# EAGLE design Layout (EAGLE 9.6.0)

## Sheet 1 of 2
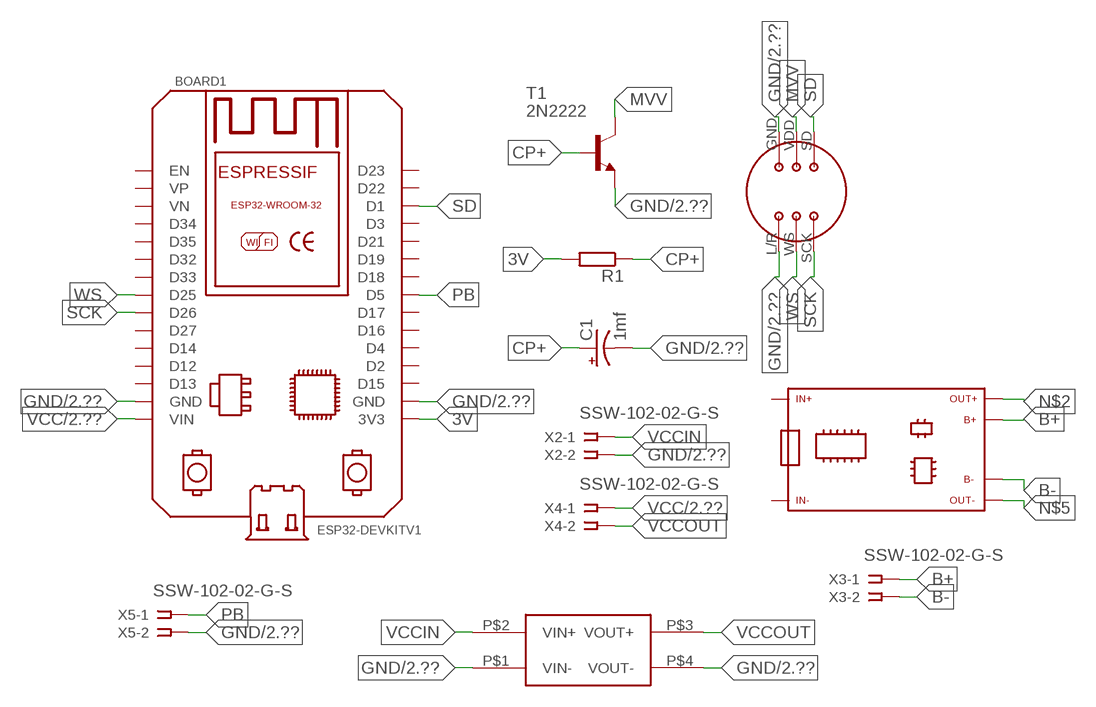
[diagram p0: schematic, sheet 1]

### Parts
BOARD1  ESP32DEVKITV1  [ESP32-DEVKITV1]
C1  1mf  1000UF-RADIAL-5MM-35V-20%-KIT  [CPOL-RADIAL-5MM-10MM-KIT]
CHARGER_HW-1  CHARGER_HW-107  [CHARGER_HW-107]
INMP1  INMP441  [INMP441]
R1  R-EU_0204/7  [0204/7]
T1  2N2222  [TO18]
U$2  MP1584-MINI-SMD  [MINI-DC-BRICK-SMD]
X2  SSW-102-02-G-S  [SSW-102-02-G-S]
X3  SSW-102-02-G-S  [SSW-102-02-G-S]
X4  SSW-102-02-G-S  [SSW-102-02-G-S]
X5  SSW-102-02-G-S  [SSW-102-02-G-S]

### Nets
3V: BOARD1.3V3 R1.2
B+: CHARGER_HW-1.B+ X3.1
B-: CHARGER_HW-1.B- X3.2
CP+: C1.+ R1.1 T1.2(B)
GND: BOARD1.GND BOARD1.GND@1(GND) C1.- INMP1.GND INMP1.L/R T1.1(E) U$2.P$1(VIN-) U$2.P$4(VOUT-) X2.2 X5.2 ; also sheet 2
MVV: INMP1.VDD T1.3(C)
N$2: CHARGER_HW-1.OUT+
N$5: CHARGER_HW-1.OUT-
PB: BOARD1.D5 X5.1
SCK: BOARD1.D26 INMP1.SCK
SD: BOARD1.D1 INMP1.SD
VCC: BOARD1.VIN X4.1 ; also sheet 2
VCCIN: U$2.P$2(VIN+) X2.1
VCCOUT: U$2.P$3(VOUT+) X4.2
WS: BOARD1.D25 INMP1.WS
Unconnected: BOARD1.D2 BOARD1.D3 BOARD1.D4 BOARD1.D12 BOARD1.D13 BOARD1.D14 BOARD1.D15 BOARD1.D16 BOARD1.D17 BOARD1.D18 BOARD1.D19 BOARD1.D21 BOARD1.D22 BOARD1.D23 BOARD1.D27 BOARD1.D32 BOARD1.D33 BOARD1.D34 BOARD1.D35 BOARD1.EN BOARD1.VN BOARD1.VP CHARGER_HW-1.IN+ CHARGER_HW-1.IN-

## Sheet 2 of 2
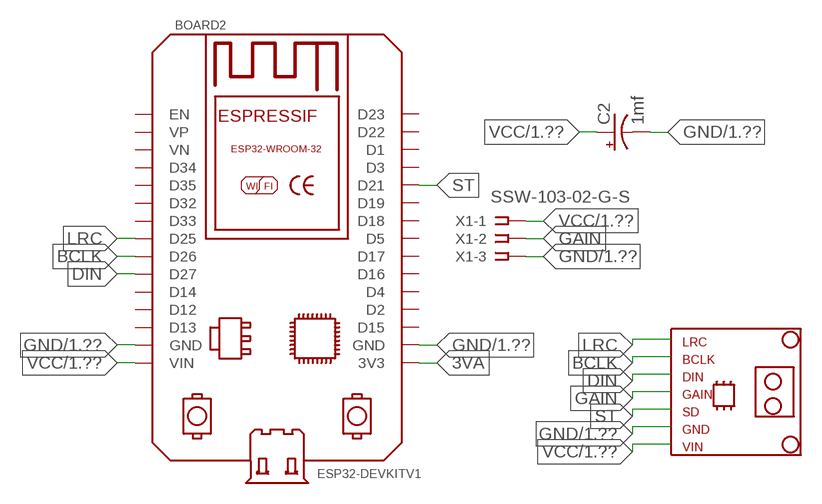
[diagram p1: schematic, sheet 2]

### Parts
BOARD2  ESP32DEVKITV1  [ESP32-DEVKITV1]
C2  1mf  1000UF-RADIAL-5MM-35V-20%-KIT  [CPOL-RADIAL-5MM-10MM-KIT]
MAX98357A1  MAX98357A  [MAX98357A]
X1  SSW-103-02-G-S  [SSW-103-02-G-S]

### Nets
3VA: BOARD2.3V3
BCLK: BOARD2.D26 MAX98357A1.BCLK
DIN: BOARD2.D27 MAX98357A1.DIN
GAIN: MAX98357A1.GAIN X1.2
GND: BOARD2.GND BOARD2.GND@1(GND) C2.- MAX98357A1.GND X1.3 ; also sheet 1
LRC: BOARD2.D25 MAX98357A1.LRC
ST: BOARD2.D21 MAX98357A1.SD
VCC: BOARD2.VIN C2.+ MAX98357A1.VIN X1.1 ; also sheet 1
Unconnected: BOARD2.D1 BOARD2.D2 BOARD2.D3 BOARD2.D4 BOARD2.D5 BOARD2.D12 BOARD2.D13 BOARD2.D14 BOARD2.D15 BOARD2.D16 BOARD2.D17 BOARD2.D18 BOARD2.D19 BOARD2.D22 BOARD2.D23 BOARD2.D32 BOARD2.D33 BOARD2.D34 BOARD2.D35 BOARD2.EN BOARD2.VN BOARD2.VP

## Library data of the parts
BOARD1 BOARD2 = ESP32-DEVKITV1:ESP32DEVKITV1: https://github.com/shridattdudhat
C1 C2 = SparkFun-Capacitors:1000UF: 1,000µF/1mF ceramic capacitors A capacitor is a passive two-terminal electrical component used to store electrical energy temporarily in an electric field. CAP-08070; PROD_ID: CAP-09538
CHARGER_HW-1 = Modul-Charger-W-107:CHARGER_HW-107
INMP1 = INMP441:INMP441
MAX98357A1 = Ampli_MAX98357A:MAX98357A
R1 = rcl:R-EU_: RESISTOR, European symbol; SPICEPREFIX: R
T1 = transistor:2N2222: NPN TRANSISTOR
U$2 = MP1584-dc-brick:MP1584-MINI-SMD
X1 = con-samtec:SSW-103-02-G-S: THROUGH-HOLE .025" SQ POST SOCKET Source: Samtec SSW.pdf; MF: Samtec Inc.; MPN: SSW-103-02-G-S; OC_FARNELL: unknown; OC_NEWARK: 11P9367
X2-X5 = con-samtec:SSW-102-02-G-S: THROUGH-HOLE .025" SQ POST SOCKET Source: Samtec SSW.pdf; MF: Samtec Inc.; MPN: SSW-102-02-G-S; OC_FARNELL: unknown; OC_NEWARK: 11P9351

## Board
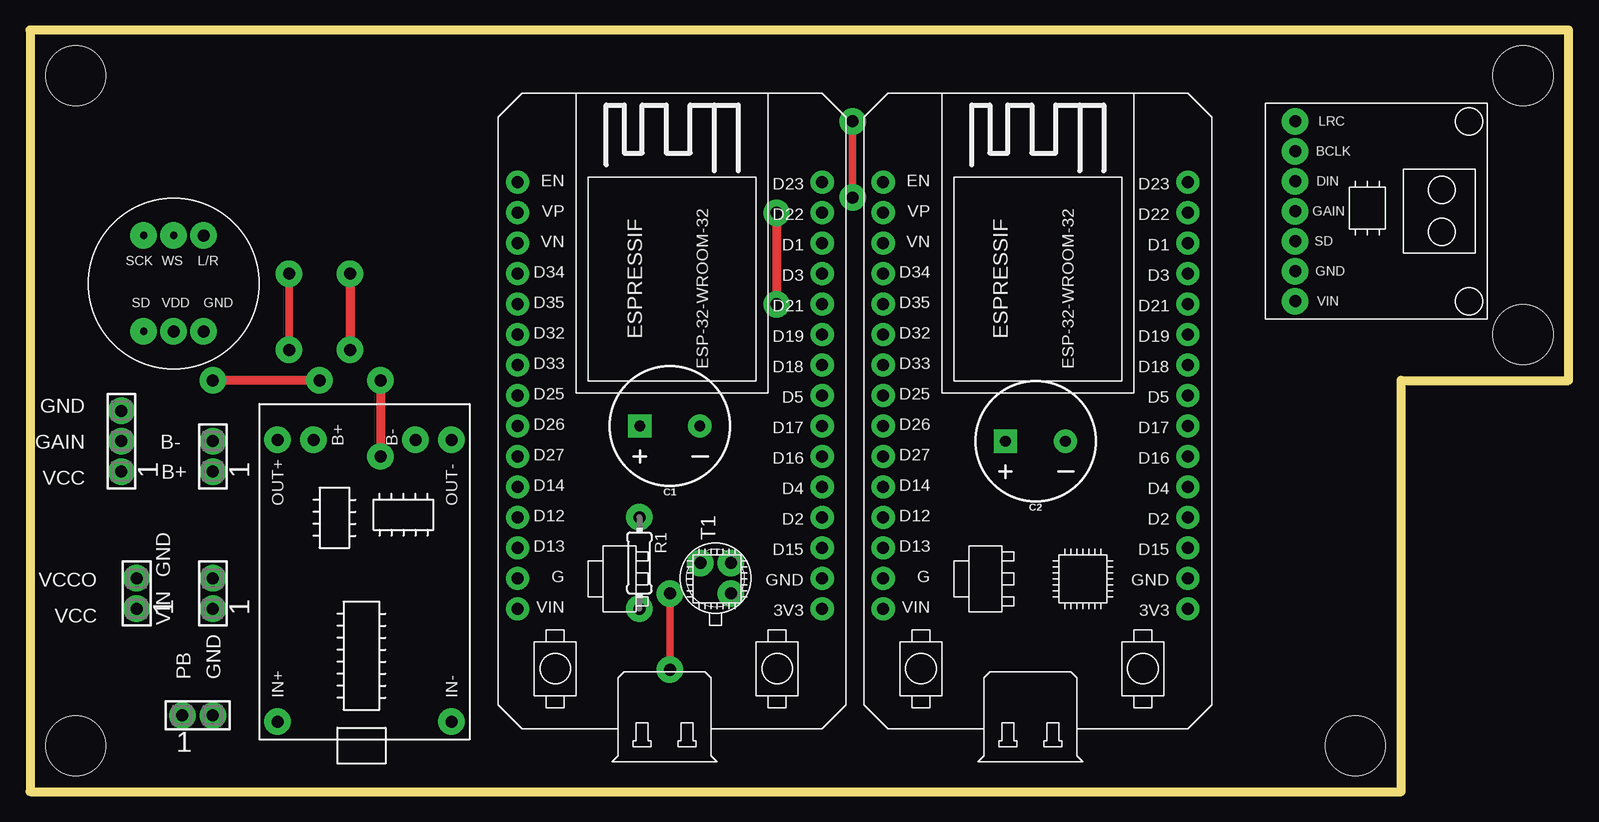
[diagram p2: board, top side]
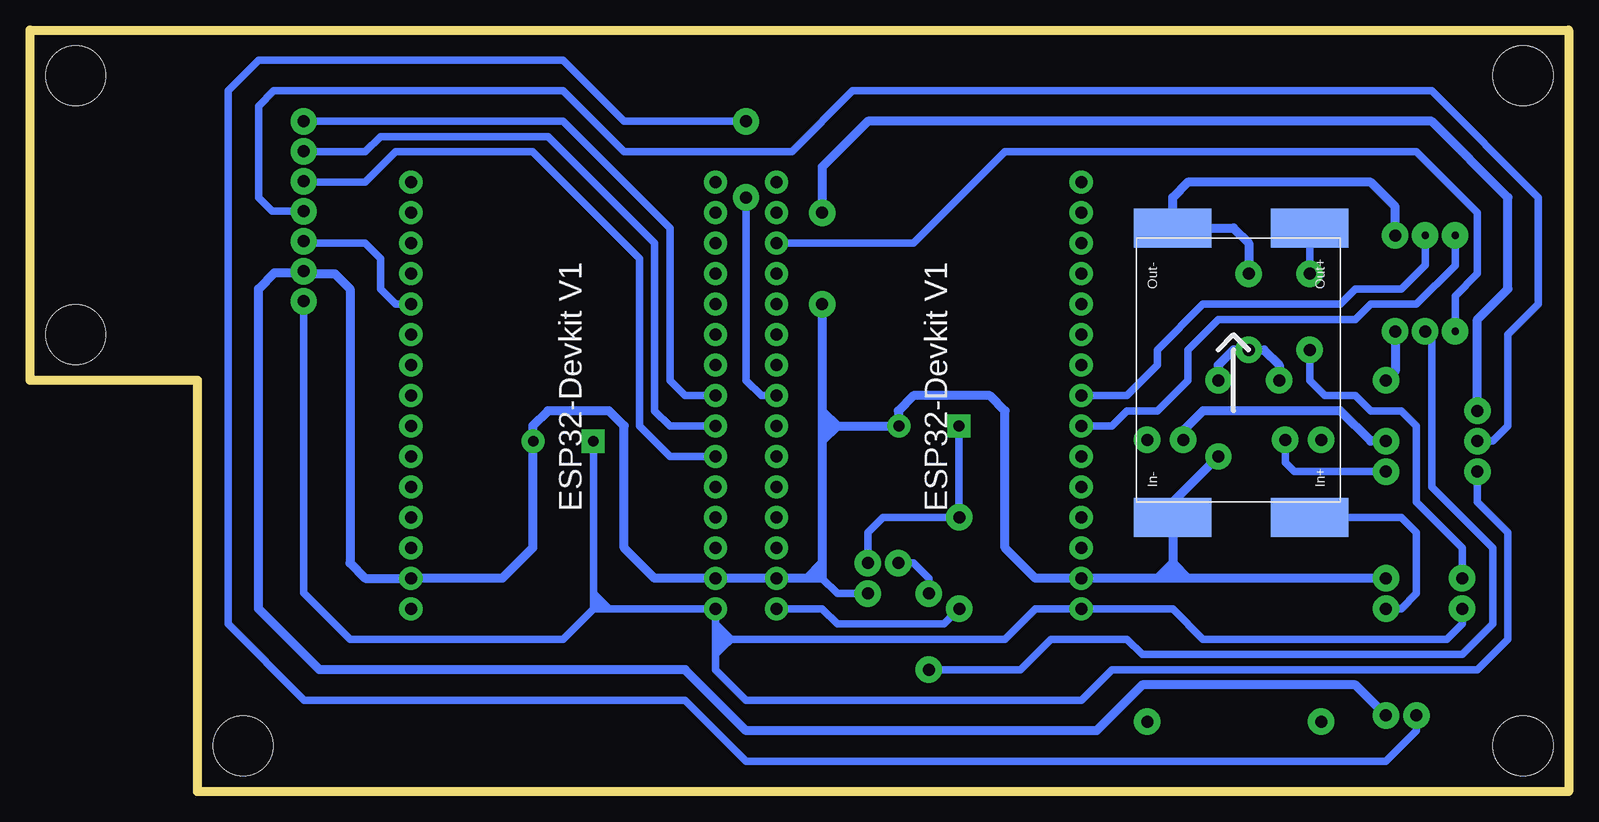
[diagram p3: board, bottom side, seen from below]

Size 128.27 x 63.5 mm. Coordinates in mm from the lower left corner, seen from the top.
Outline: 0,63.5 0,0 114.3,0 114.3,34.29 128.27,34.29 128.27,63.5 0,63.5
Copper layers (1*16): Top 0.035mm / dielectric 1.5mm / Bottom 0.035mm
Design rules "default": minimum track width 6mil, minimum drill 0.35mm, track to track 6mil, track to pad 6mil, pad to pad 6mil, via to via 6mil, smd to smd 6mil, copper to edge 40mil, drill to drill 6mil, minimum pad ring 10mil, minimum via ring 8mil, stop-mask expansion 4mil, vias tented up to drill 0mil, thermal gap 10mil
Holes 5 mm at 3.81,59.69 3.81,3.81 110.49,3.81 124.46,59.69 124.46,38.1

### Footprints (pad centres in the part's own frame; a part is rotated, then mirrored left to right if it is on the bottom)
ESP32-DEVKITV1 = drill 1 pad 1.93: 3V3 0,0; D1 30.48,0; D2 7.62,0; D3 27.94,0; D4 10.16,0; D5 17.78,0; D12 7.62,25.4; D13 5.08,25.4; D14 10.16,25.4; D15 5.08,0; D16 12.7,0; D17 15.24,0; D18 20.32,0; D19 22.86,0; D21 25.4,0; D22 33.02,0; D23 35.56,0; D25 17.78,25.4; D26 15.24,25.4; D27 12.7,25.4; D32 22.86,25.4; D33 20.32,25.4; D34 27.94,25.4; D35 25.4,25.4; EN 35.56,25.4; GND 2.54,25.4; GND@1 2.54,0; VIN 0,25.4; VN 30.48,25.4; VP 33.02,25.4
CPOL-RADIAL-5MM-10MM-KIT = drill 0.9 pad 1.93 square: + 2.5,0 | drill 0.9 pad 1.93: - -2.5,0
CHARGER_HW-107 = drill 1 pad 2.2: B+ 9,0.5; B- 9,-8; IN+ -14.5,3.5; IN- -14.5,-11; OUT+ 9,3.5; OUT- 9,-11
INMP441 = drill 1 pad 2.2: GND -0.5,1; L/R -0.5,-7; VDD 2,1 | drill 0.6 pad 2.2: SCK 4.5,-7; SD 4.5,1; WS 2,-7
MAX98357A = drill 1 pad 2.2: BCLK 5.72,8.23; DIN 3.22,8.23; GAIN 0.72,8.23; GND -4.28,8.23; LRC 8.22,8.23; SD -1.78,8.23; VIN -6.78,8.23
0204/7 = drill 0.813 octagon: 1 -3.81,0; 2 3.81,0
TO18 = drill 0.813 octagon: 1 -1.27,-1.27; 2 1.27,-1.27; 3 1.27,1.27
MINI-DC-BRICK-SMD = smd 3.251 x 6.452: P$1 -11.43,5.08; P$2 -11.43,-6.35; P$3 12.7,-6.35; P$4 12.7,5.08
SSW-103-02-G-S = drill 1 pad 1.5 octagon: 1 -2.54,0; 2 0,0; 3 2.54,0
SSW-102-02-G-S = drill 1 pad 1.5 octagon: 1 -1.27,0; 2 1.27,0

### Placement (x,y rotation side)
BOARD1  66.04,15.24 90 top
BOARD2  96.52,15.24 90 top
C1  53.34,30.48 180 top
C2  83.82,29.21 180 top
CHARGER_HW-1  24.13,20.32 90 top
INMP1  13.97,39.37 180 top
MAX98357A1  113.69,47.66 90 top
R1  50.8,19.05 270 top
T1  57.15,17.78 90 top
U$2  27.94,34.29 90 bottom
X1  7.62,29.21 90 top
X2  15.24,16.51 90 top
X3  15.24,27.94 90 top
X4  8.89,16.51 90 top
X5  13.97,6.35 0 top

### Tracks (layer width: path | path; a pad name or v marks a point on that pad's centre or on a via)
3V
  Bottom 0.635: R1.2 52.07,13.97 60.96,13.97 62.23,15.24 BOARD1.3V3
B+
  Bottom 0.635: CHARGER_HW-1.B+ 23.63,27.44 22.86,26.67 X3.1
B-
  Bottom 0.762: CHARGER_HW-1.B- 32.13,30.1 30.48,31.75 19.05,31.75 16.51,29.21 X3.2
BCLK
  Bottom 0.635: BOARD2.D26 74.93,30.48 76.2,31.75 76.2,45.72 85.09,54.61 99.06,54.61 100.33,53.34 105.42,53.34 MAX98357A1.BCLK
CP+
  Bottom 0.559: 50.84,22.9 R1.1
  Bottom 0.635: 50.88,22.86 50.84,22.9 C1.+ | R1.1 57.15,22.86 58.42,21.59 T1.2
DIN
  Bottom 0.635: MAX98357A1.DIN 105.38,50.8 100.33,50.8 97.79,53.34 86.36,53.34 77.47,44.45 77.47,30.48 74.93,27.94 BOARD2.D27
GAIN
  Bottom 0.635: MAX98357A1.GAIN 108.07,48.38 109.22,49.53 109.22,57.15 107.95,58.42 83.82,58.42 78.74,53.34 64.77,53.34 59.69,58.42 11.43,58.42 2.54,49.53 2.54,40.64 5.08,38.1 5.08,30.48 6.35,29.21 X1.2
GND  (via drill 1 pad 2.2)
  Top 0.762: v26.67,43.18 v26.67,36.83 | v24.13,34.29 v15.24,34.29 | v29.21,34.29 v29.21,27.94 | v62.23,48.26 v62.23,40.64
  Bottom 0.635: MAX98357A1.GND 105.33,43.26 105.26,43.18 | 62.23,17.78 60.96,16.51 T1.1
  Bottom 0.762: X2.2 31.75,17.78 | 31.75,17.78 33.02,17.78 | 33.02,17.78 34.29,17.78 | 34.29,17.78 BOARD1.GND 44.45,17.78 46.99,20.32 46.99,31.75 48.26,33.02 54.61,33.02 55.88,31.75 55.88,30.52 C1.- | C1.- 55.88,30.48 | 63.5,17.78 62.23,17.78 62.23,19.05 | 63.5,17.78 BOARD1.GND@1 BOARD2.GND 76.2,17.78 78.74,20.32 78.74,30.48 80.01,31.75 85.09,31.75 | INMP1.L/R 14.47,48.76 16.51,50.8 31.75,50.8 33.02,49.53 U$2.P$4 27.94,46.99 26.67,45.72 v26.67,43.18 | v24.13,34.29 24.13,35.56 25.4,36.83 v26.67,36.83 27.94,36.83 29.21,35.56 v29.21,34.29 | INMP1.GND 14.47,35.06 v15.24,34.29 | v29.21,27.94 33.02,24.13 U$2.P$1 33.02,19.05 | 33.02,19.05 33.02,17.78 | 31.75,17.78 33.02,19.05 | 33.02,19.05 34.29,17.78 | 85.09,31.75 86.36,30.48 86.36,29.25 C2.- 86.36,29.17 86.36,20.32 88.9,17.78 BOARD2.GND@1 100.33,17.78 101.6,19.05 101.6,41.91 102.87,43.18 105.26,43.18 | X1.3 7.62,39.37 5.08,41.91 5.08,49.53 11.43,55.88 58.42,55.88 62.23,52.07 v62.23,48.26 | 85.09,31.75 85.09,31.77 | v62.23,40.64 62.23,31.75 | 62.23,31.75 60.96,30.48 | 60.96,30.48 C1.- | 105.33,43.26 107.88,43.26 109.22,41.91 109.22,15.24 104.14,10.16 73.66,10.16 68.58,5.08 39.37,5.08 35.56,8.89 17.78,8.89 X5.2 | 62.23,31.75 62.23,30.48 | 62.23,30.48 62.23,29.21 | 62.23,29.21 62.23,19.05 | 62.23,19.05 63.5,17.78 | 60.96,30.48 62.23,29.21 | 60.96,30.48 62.23,30.48
LRC
  Bottom 0.635: MAX98357A1.LRC 83.82,55.88 74.93,46.99 74.93,34.29 73.66,33.02 BOARD2.D25
MVV  (via drill 1 pad 2.2)
  Top 0.635: v53.34,16.51 v53.34,10.16
  Bottom 0.635: v53.34,10.16 45.72,10.16 43.18,12.7 36.83,12.7 35.56,11.43 8.89,11.43 6.35,13.97 6.35,20.32 11.43,25.4 11.43,37.83 INMP1.VDD | T1.3 54.61,19.05 53.34,17.78 v53.34,16.51
N$1  (via drill 1 pad 2.2)
  other vias: 50.8,22.86
N$3  (via drill 1 pad 2.2)
  other vias: 50.8,15.24
N$4  (via drill 1 pad 2.2)
  other vias: 55.88,19.05
N$6  (via drill 1 pad 2.2)
  other vias: 58.42,16.51
N$7  (via drill 1 pad 2.2)
  other vias: 58.42,19.05
N$8  (via drill 1 pad 2.2)
  other vias: 7.62,31.75
N$9  (via drill 1 pad 2.2)
  other vias: 7.62,29.21
N$10  (via drill 1 pad 2.2)
  other vias: 7.62,26.67
N$11  (via drill 1 pad 2.2)
  other vias: 15.24,29.21
N$12  (via drill 1 pad 2.2)
  other vias: 15.24,26.67
N$13  (via drill 1 pad 2.2)
  other vias: 15.24,17.78
N$14  (via drill 1 pad 2.2)
  other vias: 15.24,15.24
N$15  (via drill 1 pad 2.2)
  other vias: 8.89,15.24
N$16  (via drill 1 pad 2.2)
  other vias: 8.89,17.78
N$17  (via drill 1 pad 2.2)
  other vias: 12.7,6.35
N$18  (via drill 1 pad 2.2)
  other vias: 15.24,6.35
PB  (via drill 1 pad 2.2)
  Top 0.635: v68.58,55.88 v68.58,49.53
  Bottom 0.635: X5.1 12.7,5.08 15.24,2.54 68.58,2.54 73.66,7.62 105.41,7.62 111.76,13.97 111.76,58.42 109.22,60.96 83.82,60.96 78.74,55.88 v68.58,55.88 | v68.58,49.53 68.58,34.29 67.31,33.02 BOARD1.D5
SCK
  Bottom 0.635: INMP1.SCK 9.47,43.87 12.7,40.64 16.51,40.64 17.78,39.37 29.21,39.37 31.75,36.83 31.75,34.29 34.29,31.75 36.83,31.75 38.1,30.48 BOARD1.D26
SD
  Bottom 0.635: INMP1.SD 9.47,41.33 7.62,43.18 7.62,48.26 12.7,53.34 46.99,53.34 54.61,45.72 BOARD1.D1
ST
  Bottom 0.635: MAX98357A1.SD 105.3,45.72 100.33,45.72 99.06,44.45 99.06,41.91 97.79,40.64 BOARD2.D21
VCC
  Bottom 0.635: X4.1 8.89,13.97 10.16,12.7 30.48,12.7 33.02,15.24 BOARD1.VIN 44.45,15.24 46.99,12.7 69.85,12.7 | C2.+ 81.28,29.17 81.28,16.51 | 81.28,15.24 81.28,16.51 | X1.1 7.62,24.13 5.08,21.59 5.08,12.7 7.62,10.16 38.1,10.16 40.64,7.62 68.58,7.62 71.12,10.16 71.12,11.43 | 71.12,11.43 71.12,12.7 | 71.12,13.97 BOARD2.VIN 80.01,15.24 | 71.12,12.7 69.85,12.7 | 69.85,12.7 70.48,13.34 | 70.48,13.34 71.12,13.97 | 71.12,13.97 71.12,12.7 | 71.12,12.7 70.48,13.34 | 69.85,12.7 70.48,12.06 | 70.48,12.06 71.12,11.43 | 70.48,12.06 71.12,12.7 | MAX98357A1.VIN 105.46,16.56 101.6,12.7 83.82,12.7 81.28,15.24 | 80.01,15.24 81.28,15.24 | 80.01,15.24 80.64,15.88 | 80.64,15.88 81.28,16.51 | 81.28,15.24 80.64,15.88
VCCIN
  Bottom 0.635: X2.1 13.97,15.24 12.7,16.51 12.7,21.59 13.97,22.86 19.05,22.86 | 19.05,22.86 20.32,21.59 22.86,21.59 22.86,22.86 U$2.P$2 19.05,22.86
VCCOUT  (via drill 1 pad 2.2)
  Top 0.635: v21.59,36.83 v21.59,43.18
  Bottom 0.635: v21.59,36.83 21.59,34.29 20.32,33.02 17.78,33.02 16.51,31.75 13.97,31.75 12.7,30.48 12.7,24.13 8.89,20.32 X4.2 | v21.59,43.18 U$2.P$3
WS
  Bottom 0.635: 11.97,45.18 INMP1.WS 11.97,43.91 13.97,41.91 17.78,41.91 19.05,40.64 30.48,40.64 34.29,36.83 34.29,35.56 36.83,33.02 BOARD1.D25

### Text on the board
tNames: GND | GAIN | B- | VCC | B+ | VCCO | GND | VCC | VIN | GND | PB